# EAGLE board tottag (EAGLE 9.1.1)
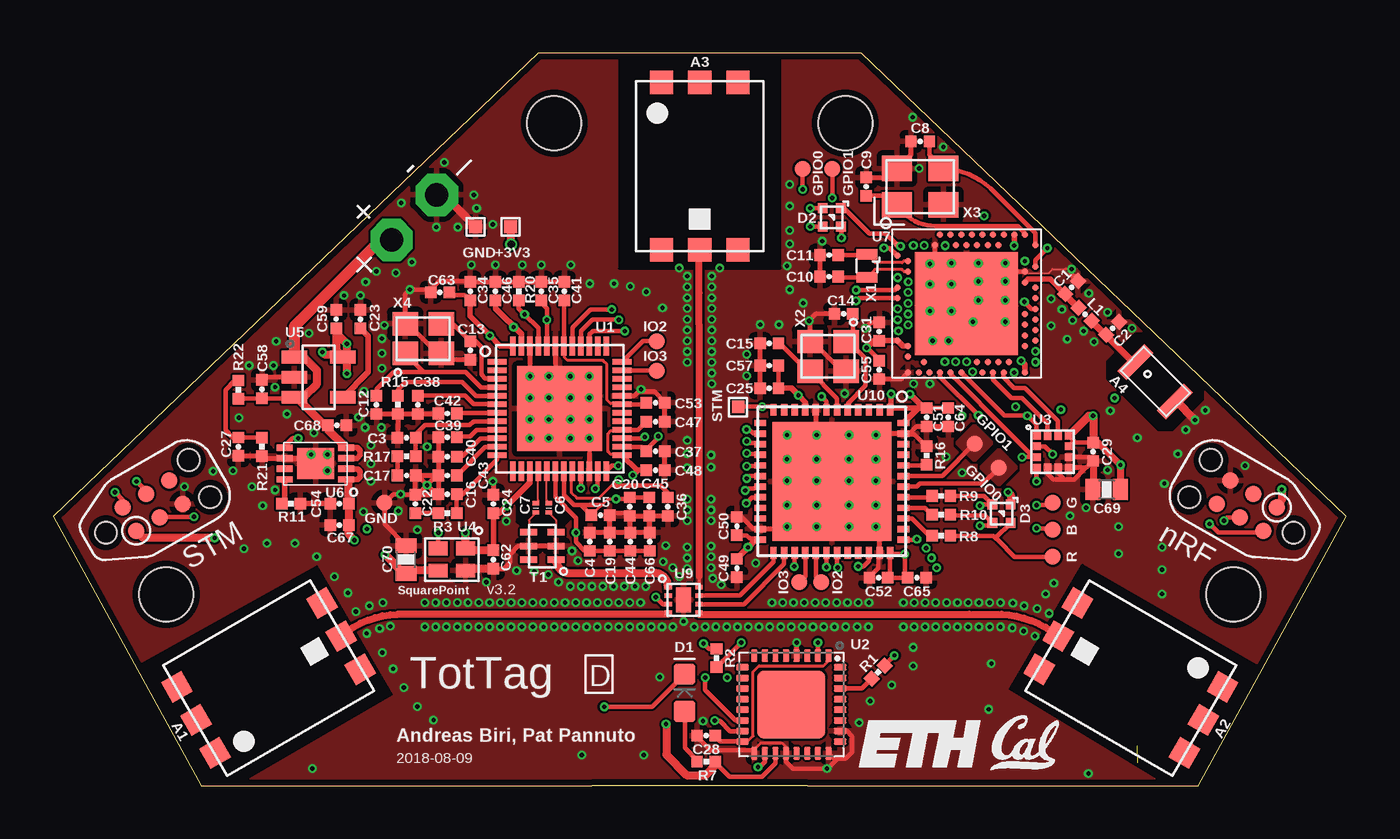
[diagram p4: board, top side]
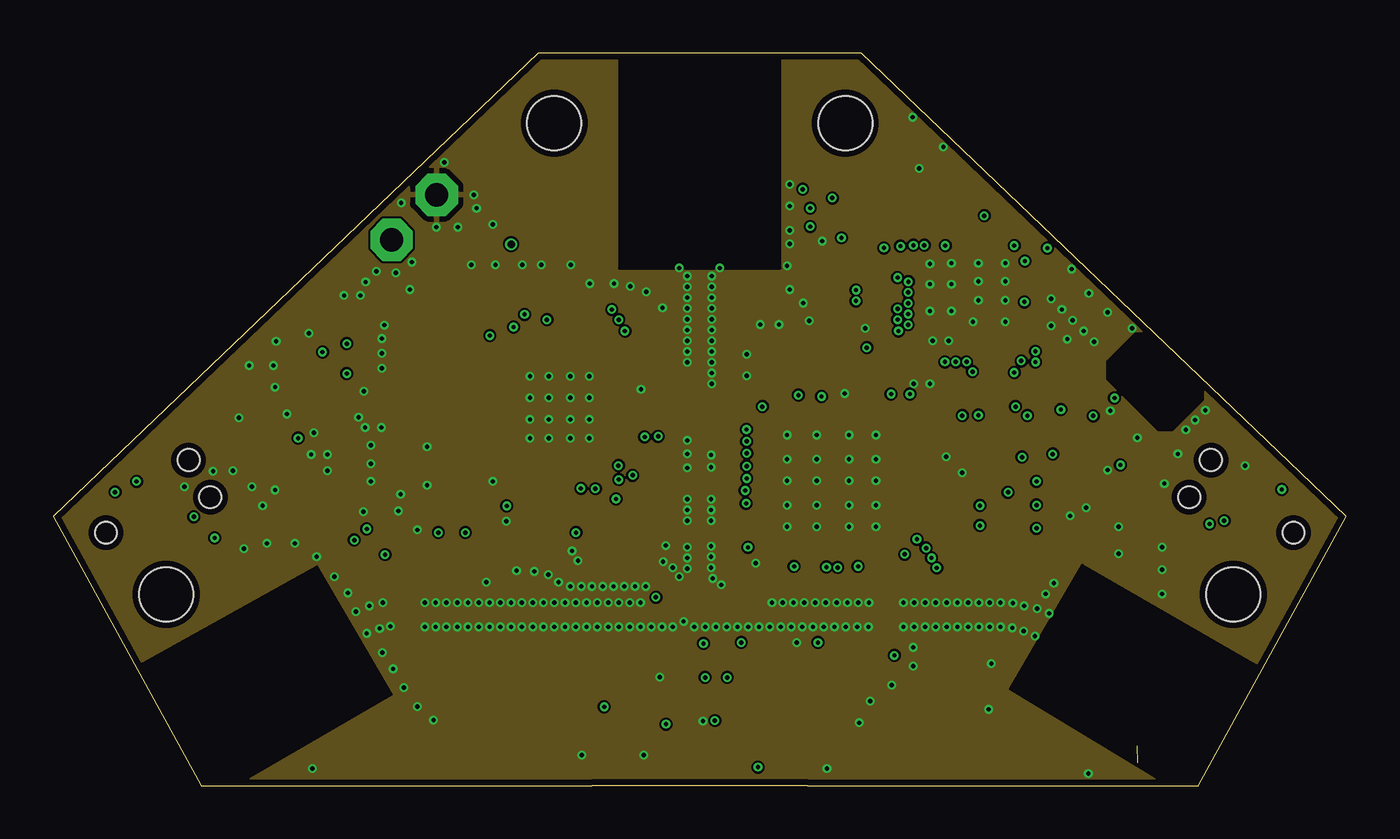
[diagram p5: board, inner layer Route2]
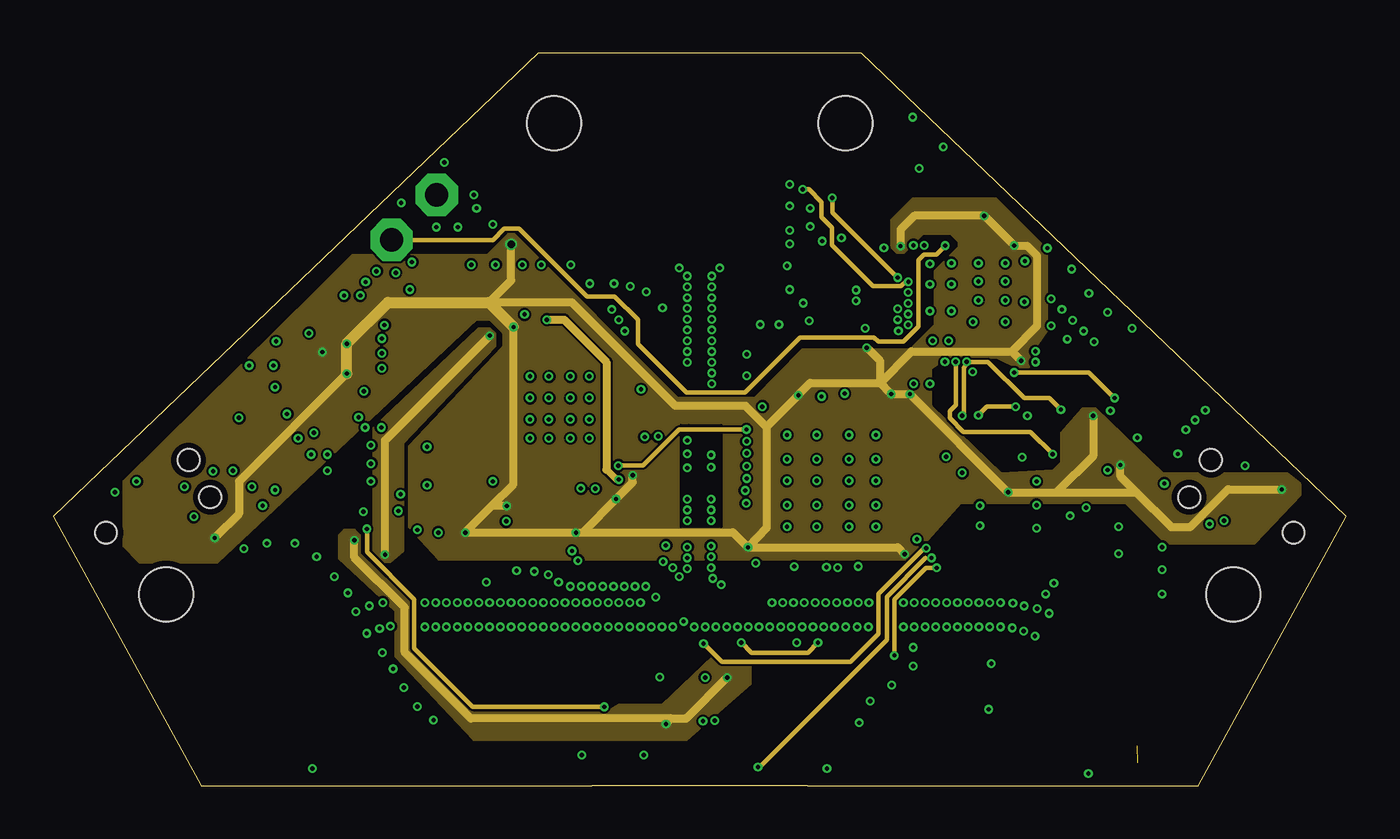
[diagram p6: board, inner layer Route15]
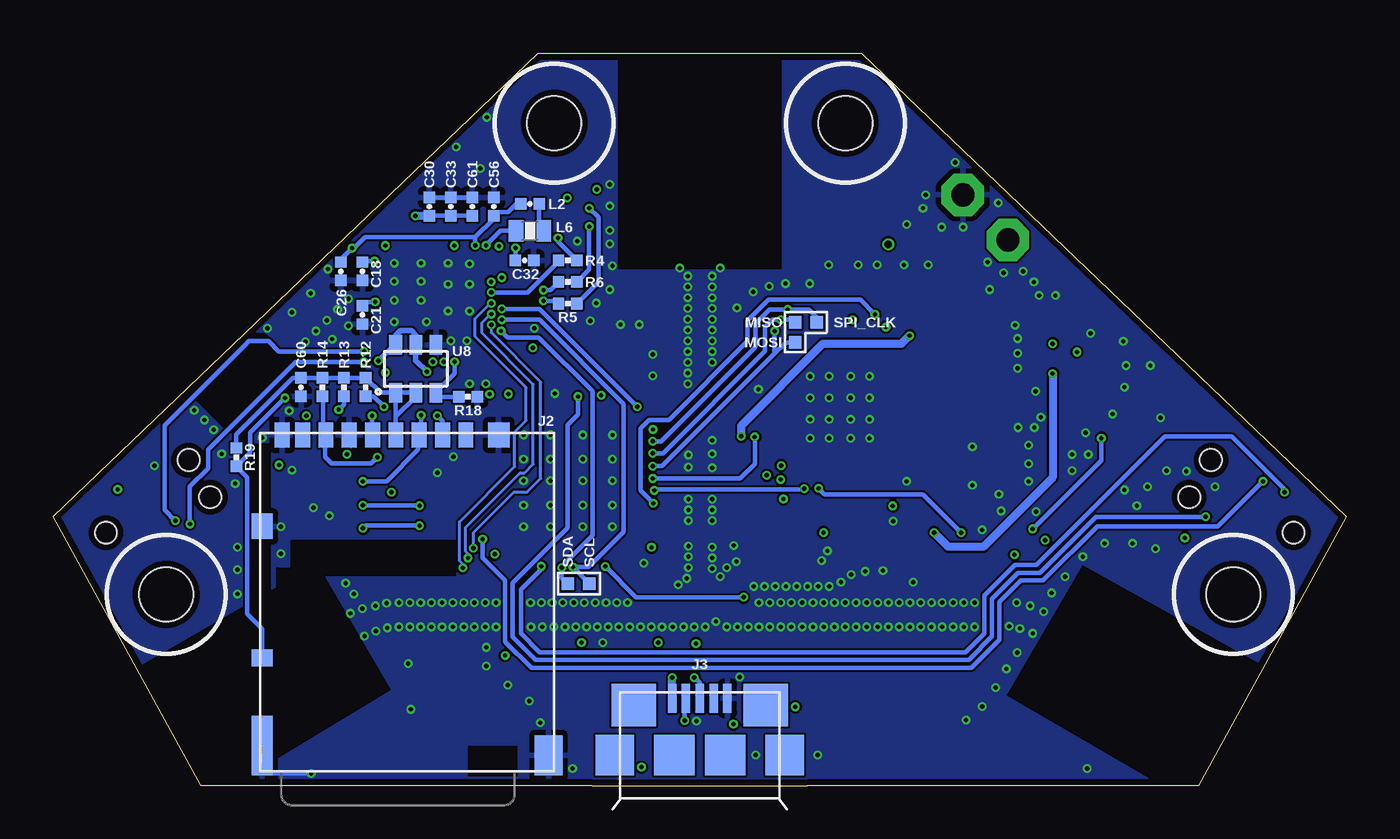
[diagram p7: board, bottom side, seen from below]

Size 60.96 x 34.54 mm. Coordinates in mm from the lower left corner, seen from the top.
Outline: 35.56,0 53.98,0 60.96,12.7 38.1,34.54 22.86,34.54 0,12.7 6.98,0 25.4,0
Copper layers (1+2*15+16): Top 0.0356mm / dielectric 0.18mm / Route2 0.0356mm / dielectric 1.03mm / Route15 0.0356mm / dielectric 0.18mm / Bottom 0.0356mm
Design rules "quickturn_co_kr_1oz_4lyr *": minimum track width 4mil, minimum drill 8mil, track to track 4mil, track to pad 4mil, pad to pad 4mil, via to via 4mil, smd to smd 4mil, copper to edge 12mil, drill to drill 12mil, minimum pad ring 8mil, minimum via ring 4mil, stop-mask expansion 3mil, vias tented up to drill 50mil, thermal gap 10mil
Holes 2.54 mm at 55.63,9.02 5.33,9.02 23.62,31.24 37.34,31.24
tKeepout: area 15.7,7 to 28.7,9; area 30.7,7 to 45.2,9; area 29.5,9.8 to 31.5,22.9
tRestrict: area 4.1,0.1 to 16,10.3; area 45.1,0.3 to 56.9,10.4; area 26.7,24.4 to 34.3,34.4; area 21.8,12.2 to 24.4,14.4
bRestrict: area 4.1,0.1 to 16,10.3; area 45.1,0.3 to 56.9,10.4; area 26.7,24.4 to 34.3,34.4

## Footprints (pad centres in the part's own frame; a part is rotated, then mirrored left to right if it is on the bottom)
TAIYO-YUDEN-AH086M = smd 1.1 x 1.1: A 0,-3.95; NC0 -1.8,3.95; NC1 0,3.95; NC2 1.8,3.95; NC3 1.8,-3.95; NC4 -1.8,-3.95
ANT3216A063R2400A = smd 0.6 x 1.8: S1 -1.325,0; S2 1.325,0
0402_CAP = smd 0.536 x 0.546: 1 -0.433,0; 2 0.433,0
0201_CAP = smd 0.3 x 0.21: P$1 0,0.22; P$2 0,-0.22
0603_CAP = smd 0.7 x 1: 1 -0.65,0; 2 0.65,0
LED-0603 = smd 1 x 1: A -0.877,0; C 0.877,0
1MM_SQ_4PAD = smd 0.457 x 0.457: 1 0.432,0.432; 2 0.432,-0.432; 3 -0.432,-0.432; 4 -0.432,0.432
PAD.03X.03 = smd 0.762 x 0.762: P$1 0,0
BATTERY_HOLE = drill 1.1 pad 2 octagon: N 1.5,0; P -1.5,0
DM3AT-SF-PEJM5 = smd 0.7 x 1.2: 1 3.2,-0.1; 2 2.1,-0.1; 3 1,-0.1; 4 -0.1,-0.1; 5 -1.2,-0.1; 6 -2.3,-0.1; 7 -3.4,-0.1; 8 -4.5,-0.1; B -5.45,-0.1 | smd 1 x 0.8: A -6.4,-10.6 | smd 1 x 1.2: MOUNT0 4.75,-0.1; MOUNT1 -6.4,-4.4 | smd 1 x 2.8: MOUNT2 -6.4,-14.75 | smd 1.3 x 1.9: MOUNT3 7.1,-15.2
USB_MICRO_B-HIROSE-ZX62-B-5PA(11) = smd 0.4 x 1.35: 1 -1.3,4.125; 2 -0.65,4.125; 3 0,4.125; 4 0.65,4.125; 5 1.3,4.125 | smd 2.1 x 2: P$1 3.1,3.8; P$2 -3.1,3.8 | smd 1.8 x 1.9: P$3 -4,1.45; P$6 4,1.45 | smd 1.9 x 1.9: P$4 -1.2,1.45; P$5 1.2,1.45
TC2030-IDC-NL = smd 0.787 x 0.787: 1 -1.27,-0.635; 2 -1.27,0.635; 3 0,-0.635; 4 0,0.635; 5 1.27,-0.635; 6 1.27,0.635 | hole 1.016: -2.54,0; 2.54,1.016; 2.54,-1.016
TP06SQ = smd 0.6 x 0.6: TP 0,0
0402_RES = smd 0.536 x 0.546: 1 -0.433,0; 2 0.433,0
EIA-0805 = smd 0.3 x 0.8: 1 -0.65,-0.65; 2 0,-0.65; 3 0.65,-0.65; 4 0.65,0.65; 5 0,0.65; 6 -0.65,0.65
QFN-48-DW1000 = smd 0.9 x 0.26: 1 -2.95,2.2; 2 -2.95,1.8; 3 -2.95,1.4; 4 -2.95,1; 5 -2.95,0.6; 6 -2.95,0.2; 7 -2.95,-0.2; 8 -2.95,-0.6; 9 -2.95,-1; 10 -2.95,-1.4; 11 -2.95,-1.8; 12 -2.95,-2.2; 25 2.95,-2.2; 26 2.95,-1.8; 27 2.95,-1.4; 28 2.95,-1; 29 2.95,-0.6; 30 2.95,-0.2; 31 2.95,0.2; 32 2.95,0.6; 33 2.95,1; 34 2.95,1.4; 35 2.95,1.8; 36 2.95,2.2 | smd 0.26 x 0.9: 13 -2.2,-2.95; 14 -1.8,-2.95; 15 -1.4,-2.95; 16 -1,-2.95; 17 -0.6,-2.95; 18 -0.2,-2.95; 19 0.2,-2.95; 20 0.6,-2.95; 21 1,-2.95; 22 1.4,-2.95; 23 1.8,-2.95; 24 2.2,-2.95; 37 2.2,2.95; 38 1.8,2.95; 39 1.4,2.95; 40 1,2.95; 41 0.6,2.95; 42 0.2,2.95; 43 -0.2,2.95; 44 -0.6,2.95; 45 -1,2.95; 46 -1.4,2.95; 47 -1.8,2.95; 48 -2.2,2.95 | smd 4 x 4: GND 0,0
QFN32 = smd 0.6 x 0.3: 1 -2.3,1.75; 2 -2.3,1.25; 3 -2.3,0.75; 4 -2.3,0.25; 5 -2.3,-0.25; 6 -2.3,-0.75; 7 -2.3,-1.25; 8 -2.3,-1.75; 17 2.3,-1.75; 18 2.3,-1.25; 19 2.3,-0.75; 20 2.3,-0.25; 21 2.3,0.25; 22 2.3,0.75; 23 2.3,1.25; 24 2.3,1.75 | smd 0.3 x 0.6: 9 -1.75,-2.3; 10 -1.25,-2.3; 11 -0.75,-2.3; 12 -0.25,-2.3; 13 0.25,-2.3; 14 0.75,-2.3; 15 1.25,-2.3; 16 1.75,-2.3; 25 1.75,2.3; 26 1.25,2.3; 27 0.75,2.3; 28 0.25,2.3; 29 -0.25,2.3; 30 -0.75,2.3; 31 -1.25,2.3; 32 -1.75,2.3 | smd 3.2 x 3.2: EXP 0,0
LGA-12 = smd 0.375 x 0.35: 1 -0.75,0.75; 2 -0.75,0.25; 3 -0.75,-0.25; 4 -0.75,-0.75; 7 0.75,-0.75; 8 0.75,-0.25; 9 0.75,0.25; 10 0.75,0.75 | smd 0.35 x 0.375: 5 -0.25,-0.75; 6 0.25,-0.75; 11 0.25,0.75; 12 -0.25,0.75
LXDC2HN = smd 0.65 x 0.9: 1 -0.525,0.65; 2 -0.525,-0.65; 3 0.525,-0.65; 4 0.525,0.65
SOT-23-5 = smd 0.6 x 1.2: 1 -0.95,-1.15; 2 0,-1.15; 3 0.95,-1.15; 4 0.95,1.15; 5 -0.95,1.15
DFN-8-MCP = smd 0.75 x 0.3: 1 -1.45,0.75; 2 -1.45,0.25; 3 -1.45,-0.25; 4 -1.45,-0.75; 5 1.45,-0.75; 6 1.45,-0.25; 7 1.45,0.25; 8 1.45,0.75 | smd 1.75 x 1.45: GND 0,0
AQFN73 = smd 0.3 x 0.3: A8 -1.25,3.25; A10 -0.75,3.25; A12 -0.25,3.25; A14 0.25,3.25; A16 0.75,3.25; A18 1.25,3.25; A20 1.75,3.25; A22 2.25,3.25; A23 2.75,3.25; AA24 3.25,-2.25; AB2 -2.75,-2.5; AC5 -2,-2.75; AC9 -1,-2.75; AC11 -0.5,-2.75; AC13 0,-2.75; AC15 0.5,-2.75; AC17 1,-2.75; AC19 1.5,-2.75; AC21 2,-2.75; AC24 3.25,-2.75; AD2 -2.75,-3.25; AD4 -2.25,-3.25; AD6 -1.75,-3.25; AD8 -1.25,-3.25; AD10 -0.75,-3.25; AD12 -0.25,-3.25; AD14 0.25,-3.25; AD16 0.75,-3.25; AD18 1.25,-3.25; AD20 1.75,-3.25; AD22 2.25,-3.25; AD23 2.75,-3.25; B1 -3.25,2.75; B3 -2.5,2.75; B5 -2,2.75; B7 -1.5,2.75; B9 -1,2.75; B11 -0.5,2.75; B13 0,2.75; B15 0.5,2.75; B17 1,2.75; B19 1.5,2.75; B24 3.25,2.75; C1 -3.25,2.25; D2 -2.75,2; D23 2.75,2; E24 3.25,1.75; F2 -2.75,1.5; F23 2.75,1.5; G1 -3.25,1.25; H2 -2.75,1; H23 2.75,1; J1 -3.25,0.75; J24 3.25,0.75; K2 -2.75,0.5; L1 -3.25,0.25; L24 3.25,0.25; M2 -2.75,0; N1 -3.25,-0.25; N24 3.25,-0.25; P2 -2.75,-0.5; P23 2.75,-0.5; R1 -3.25,-0.75; R24 3.25,-0.75; T2 -2.75,-1; T23 2.75,-1; U1 -3.25,-1.25; U24 3.25,-1.25; V23 2.75,-1.5; W1 -3.25,-1.75; W24 3.25,-1.75; Y2 -2.75,-2; Y23 2.75,-2 | smd 4.85 x 4.85: GND 0,0
TSOT23-6 = smd 0.6 x 0.927: 1 -0.95,-1.126; 2 0,-1.126; 3 0.95,-1.126; 4 0.95,1.126; 5 0,1.126; 6 -0.95,1.126
MLPQ-UT-8 = smd 0.35 x 0.2: 1 -0.725,0.6; 2 -0.725,0.2; 3 -0.725,-0.2; 4 -0.725,-0.6; 5 0.725,-0.6; 6 0.725,-0.2; 7 0.725,0.2; 8 0.725,0.6 | smd 0.7 x 1.2: GND 0,0
UFQFPN-48 = smd 0.55 x 0.3: 1 -3.375,2.75; 2 -3.375,2.25; 3 -3.375,1.75; 4 -3.375,1.25; 5 -3.375,0.75; 6 -3.375,0.25; 7 -3.375,-0.25; 8 -3.375,-0.75; 9 -3.375,-1.25; 10 -3.375,-1.75; 11 -3.375,-2.25; 12 -3.375,-2.75; 25 3.375,-2.75; 26 3.375,-2.25; 27 3.375,-1.75; 28 3.375,-1.25; 29 3.375,-0.75; 30 3.375,-0.25; 31 3.375,0.25; 32 3.375,0.75; 33 3.375,1.25; 34 3.375,1.75; 35 3.375,2.25; 36 3.375,2.75 | smd 0.3 x 0.55: 13 -2.75,-3.375; 14 -2.25,-3.375; 15 -1.75,-3.375; 16 -1.25,-3.375; 17 -0.75,-3.375; 18 -0.25,-3.375; 19 0.25,-3.375; 20 0.75,-3.375; 21 1.25,-3.375; 22 1.75,-3.375; 23 2.25,-3.375; 24 2.75,-3.375; 37 2.75,3.375; 38 2.25,3.375; 39 1.75,3.375; 40 1.25,3.375; 41 0.75,3.375; 42 0.25,3.375; 43 -0.25,3.375; 44 -0.75,3.375; 45 -1.25,3.375; 46 -1.75,3.375; 47 -2.25,3.375; 48 -2.75,3.375 | smd 5.6 x 5.6: GND 0,0
ABS05 = smd 0.5 x 1: A -0.55,0; B 0.55,0
FA-20H = smd 1.1 x 1.2: 1 -0.7,0.85; 2 -0.7,-0.85; 3 0.7,-0.85; 4 0.7,0.85
TXC-7V = smd 1.4 x 1.2: 1 -1.1,-0.85; 2 1.1,-0.85; 3 1.1,0.85; 4 -1.1,0.85

## Placement (x,y rotation side)
A1  TAIYO-YUDEN-AH086M  [TAIYO-YUDEN-AH086M]  10.16,5.08 120 top
A2  TAIYO-YUDEN-AH086M  [TAIYO-YUDEN-AH086M]  50.8,5.08 240 top
A3  TAIYO-YUDEN-AH086M  [TAIYO-YUDEN-AH086M]  30.48,29.21 0 top
A4  ANT3216A063R2400A  [ANT3216A063R2400A]  51.94,19.05 315 top
C1  1pF  [0402_CAP]  48.01,23.49 45 top
C2  1pF  [0402_CAP]  49.94,21.56 45 top
C3  1.2pF  [0402_CAP]  16.66,16.41 180 top
C4  10pF  [0402_CAP]  25.3,11.51 90 top
C5  10pF  [0402_CAP]  25.81,12.75 0 top
C6  12pF  [0201_CAP]  23.37,13.11 0 top
C7  12pF  [0201_CAP]  22.76,13.11 0 top
C8  12pF  [0402_CAP]  40.87,30.38 0 top
C9  12pF  [0402_CAP]  38.33,28.24 270 top
C10  12pF  [0402_CAP]  36.58,24 0 top
C11  12pF  [0402_CAP]  36.58,25.02 0 top
C12  12pF  [0402_CAP]  15.24,17.96 270 top
C13  12pF  [0402_CAP]  19.66,20.52 270 top
C14  12pF  [0402_CAP]  37.26,22.25 180 top
C15  12pF  [0402_CAP]  33.76,20.85 180 top
C16  18pF  [0402_CAP]  18.59,13.74 180 top
C17  27pF  [0402_CAP]  16.66,14.63 0 top
C18  100pF  [0402_CAP]  46.38,24.26 270 bottom
C19  330pF  [0402_CAP]  26.24,11.51 90 top
C20  330pF  [0402_CAP]  27.18,13.16 270 top
C21  820pF  [0402_CAP]  46.38,22.2 270 bottom
C22  820pF  [0402_CAP]  17.07,13.28 90 top
C23  10nF  [0402_CAP]  14.49,22 90 top
C24  10nF  [0402_CAP]  20.75,13.28 90 top
C25  10nF  [0402_CAP]  33.76,18.75 180 top
C26  47nF  [0402_CAP]  47.4,24.26 270 bottom
C27  0.1uF  [0402_CAP]  8.73,15.99 90 top
C28  0.1uF  [0402_CAP]  30.78,2.36 180 top
C29  0.1uF  [0402_CAP]  49.02,15.75 270 top
C30  0.1uF  [0402_CAP]  43.23,27.3 90 bottom
C31  0.1uF  [0402_CAP]  38.94,21.41 90 top
C32  0.1uF  [0402_CAP]  38.73,24.76 0 bottom
C33  0.1uF  [0402_CAP]  42.21,27.3 90 bottom
C34  0.1uF  [0402_CAP]  19.66,23.32 90 top
C35  0.1uF  [0402_CAP]  23.01,23.32 90 top
C36  0.1uF  [0402_CAP]  28.98,13.16 270 top
C37  0.1uF  [0402_CAP]  28.4,15.77 0 top
C38  0.1uF  [0402_CAP]  17.2,17.96 270 top
C39  0.1uF  [0402_CAP]  18.59,16.43 180 top
C40  0.1uF  [0402_CAP]  18.59,15.52 180 top
C41  0.1uF  [0402_CAP]  24.1,23.32 90 top
C42  0.1uF  [0402_CAP]  18.59,17.55 180 top
C43  0.1uF  [0402_CAP]  18.59,14.63 180 top
C44  0.1uF  [0402_CAP]  27.2,11.51 90 top
C45  0.1uF  [0402_CAP]  28.09,13.16 270 top
C46  0.1uF  [0402_CAP]  20.85,23.32 90 top
C47  0.1uF  [0402_CAP]  28.4,17.17 0 top
C48  0.1uF  [0402_CAP]  28.4,14.88 0 top
C49  0.1uF  [0402_CAP]  32.23,10.26 270 top
C50  0.1uF  [0402_CAP]  32.23,12.24 90 top
C51  0.1uF  [0402_CAP]  41.17,17.37 270 top
C52  0.1uF  [0402_CAP]  38.91,9.8 180 top
C53  0.1uF  [0402_CAP]  28.4,18.06 0 top
C54  1uF  [0402_CAP]  13.5,13.3 180 top
C55  1uF  [0402_CAP]  38.94,19.61 270 top
C56  1uF  [0402_CAP]  40.18,27.3 90 bottom
C57  1uF  [0402_CAP]  33.76,19.81 180 top
C58  4.7uF  [0402_CAP]  9.85,18.7 90 top
C59  4.7uF  [0402_CAP]  13.34,22 90 top
C60  4.7uF  [0402_CAP]  49.28,18.8 270 bottom
C61  4.7uF  [0402_CAP]  41.2,27.3 90 bottom
C62  4.7uF  [0402_CAP]  20.75,10.67 90 top
C63  4.7uF  [0402_CAP]  18.24,23.27 180 top
C64  4.7uF  [0402_CAP]  42.19,17.37 270 top
C65  4.7uF  [0402_CAP]  40.72,9.8 0 top
C66  4.7uF  [0402_CAP]  28.12,11.51 90 top
C67  4.7uF  [0402_CAP]  13.5,12.29 180 top
C68  4.7uF  [0402_CAP]  13.39,16.99 0 top
C69  10uF  [0603_CAP]  49.66,13.97 180 top
C70  10uF  [0603_CAP]  16.64,10.67 90 top
D1  GREEN  [LED-0603]  29.77,4.39 90 top
D2  SML-LX0404SIUPGUSB  [1MM_SQ_4PAD]  36.7,26.8 0 top
D3  SML-LX0404SIUPGUSB  [1MM_SQ_4PAD]  44.7,12.83 0 top
GPIO0  TEST-POINT  [PAD.03X.03]  44.58,14.99 0 top
GPIO1  TEST-POINT  [PAD.03X.03]  43.43,16.13 0 top
J1  BAT_HOLE  [BATTERY_HOLE]  17.02,26.8 45 top
J2  CON_MICRO_SDDM3AT-SF-PEJM5  [DM3AT-SF-PEJM5]  44.7,16.64 0 bottom
J3  MICRO_USB_B_HIROSE_ZX62-B-5PA(11)  [USB_MICRO_B-HIROSE-ZX62-B-5PA(11)]  30.48,0 0 bottom
J4  TC2030-JLINK-NL  [TC2030-IDC-NL]  56.26,13.21 150 top
J5  TC2030-JLINK-NL  [TC2030-IDC-NL]  4.7,13.21 30 top
L1  3.9nH  [0402_CAP]  48.64,22.22 135 top
L2  15nH  [0402_CAP]  38.48,27.43 0 bottom
L6  10uH  [0603_CAP]  38.48,26.16 180 bottom
MISO  TPTP06SQ  [TP06SQ]  25.98,21.84 0 bottom
MOSI  TPTP06SQ  [TP06SQ]  25.98,20.9 0 bottom
R1  0  [0402_RES]  38.89,5.36 45 top
R2  0  [0402_RES]  31.27,6.02 90 top
R3  270  [0402_RES]  18.59,12.85 180 top
R4  470  [0402_RES]  36.7,24.76 180 bottom
R5  470  [0402_RES]  36.7,22.73 180 bottom
R6  470  [0402_RES]  36.7,23.75 180 bottom
R7  1k  [0402_RES]  30.78,1.14 0 top
R8  1k  [0402_RES]  41.86,11.79 180 top
R9  1k  [0402_RES]  41.86,13.67 180 top
R10  1k  [0402_RES]  41.86,12.78 180 top
R11  2k 1%  [0402_RES]  11.22,13.3 180 top
R12  10k  [0402_RES]  46.23,18.8 90 bottom
R13  10k  [0402_RES]  47.24,18.8 90 bottom
R14  10k  [0402_RES]  48.26,18.8 90 bottom
R15  11k 1%  [0402_RES]  16.26,17.96 90 top
R16  11k  [0402_RES]  41.17,15.57 90 top
R17  16k  [0402_RES]  16.66,15.54 180 top
R18  100k  [0402_RES]  41.4,18.34 0 bottom
R19  100k  [0402_RES]  52.32,15.49 90 bottom
R20  100k  [0402_RES]  21.95,23.32 270 top
R21  2.2M  [0402_RES]  9.85,15.98 90 top
R22  10M  [0402_RES]  8.73,18.67 270 top
SPI_CLK  TPTP06SQ  [TP06SQ]  24.97,21.84 0 bottom
T1  HHM1595A1  [EIA-0805]  23.06,11.3 90 top
TP1  TPTP06SQ  [TP06SQ]  35.69,9.53 0 bottom
TP2  TPTP06SQ  [TP06SQ]  36.7,9.53 0 bottom
TP3  TPTP06SQ  [TP06SQ]  32.3,17.87 0 top
TP4  TPTP06SQ  [TP06SQ]  19.91,26.36 0 top
TP5  TEST-POINT  [PAD.03X.03]  36.2,9.6 0 top
TP6  TEST-POINT  [PAD.03X.03]  35.18,9.6 0 top
TP7  TEST-POINT  [PAD.03X.03]  47.12,13.34 0 top
TP8  TEST-POINT  [PAD.03X.03]  47.12,10.79 0 top
TP9  TEST-POINT  [PAD.03X.03]  47.12,12.07 0 top
TP10  TEST-POINT  [PAD.03X.03]  15.62,13.34 0 top
TP11  TEST-POINT  [PAD.03X.03]  28.45,20.95 0 top
TP12  TEST-POINT  [PAD.03X.03]  28.45,19.56 0 top
TP13  TEST-POINT  [PAD.03X.03]  35.33,29.08 0 top
TP14  TEST-POINT  [PAD.03X.03]  36.73,29.08 0 top
TP15  TPTP06SQ  [TP06SQ]  21.56,26.37 0 top
U1  DW1000  [QFN-48-DW1000]  23.88,17.78 0 top
U2  FT232RQ  [QFN32]  34.8,3.84 270 top
U3  LIS2DW12  [LGA-12]  47.12,15.75 0 top
U4  LXDC2HN18A  [LXDC2HN]  18.8,10.67 270 top
U5  MAX8887EZK33+T  [SOT-23-5]  12.52,19.26 270 top
U6  MCP73831  [DFN-8-MCP]  12.37,15.19 180 top
U7  NRF52840  [AQFN73]  43.05,22.73 0 top
U8  SIP32510  [TSOT23-6]  43.87,19.66 0 bottom
U9  SKY13317  [MLPQ-UT-8]  29.72,8.76 0 top
U10  STM32F091CC  [UFQFPN-48]  36.7,14.35 270 top
U$3  [ETH_200MIL]  40.64,0.89 0 top
U$4  [UCB_CAL_100MIL]  44.2,0.76 0 top
X1  32.768kHz  [ABS05]  38.35,24.51 270 top
X2  16MHz  [FA-20H]  36.53,20.24 270 top
X3  32MHz  [TXC-7V]  40.87,28.24 0 top
X4  38.4MHz  [FA-20H]  17.45,21.08 90 top

## Tracks (layer width: path | path; a pad name or v marks a point on that pad's centre or on a via)
!CHRG
  Top 0.203: R7.1 30.35,1.21 29.78,1.78 D1.A
!DW_RST  (via drill 0.2)
  Top 0.203: U1.27 27.82,16.38 v27.89,16.45 | U10.18 33.31,14.62 32.82,14.62 v32.69,14.49
  Bottom 0.203: v32.69,14.49 28.58,14.49 27.89,15.18 v27.89,16.45
!DW_SPI_CS  (via drill 0.2)
  Top 0.203: U1.24 26.34,15.09 v26.64,15.09 | U10.14 33,16.6 32.81,16.79 v32.68,16.79
  Route15 0.203: v32.68,16.79 29.51,16.79 27.81,15.09 v26.64,15.09
!FT_RST  (via drill 0.2)
  Top 0.203: v33.22,0.88 33.3,0.88 33.55,1.13 U2.18 | U7.P2 v40.3,22.24
  Route15 0.152: v33.22,0.88 33.3,0.88 | 41.12,10.74 v41.4,10.74
  Route15 0.203: 33.3,0.88 39.29,6.87 39.29,8.92 41.12,10.74
  Bottom 0.152: v41.4,10.74 41.4,10.92 41.53,11.05 41.53,12.17 38.94,14.76 38.73,14.76 38.33,15.16 38.33,18.93 40.73,21.33 40.73,21.84 40.33,22.24 v40.3,22.24
!NRF_CS_IMU  (via drill 0.2)
  Top 0.203: U7.AC11 v42.55,19.98 | v47.12,15.63 46.75,16 U3.2
  Route15 0.203: v47.12,15.63 46.06,16.69 42.91,16.69 42.27,17.33 42.27,17.67 42.55,17.95 v42.55,19.98
!NRF_CS_SD  (via drill 0.2)
  Route15 0.203: v42.85,17.45 42.93,17.53 42.93,19.73 43.05,19.86 U7.AC13 44.07,19.98 45.77,18.28 46.95,18.28 v47.5,17.74 | v47.5,17.74
  Bottom 0.203: J2.2 42.6,17.2 v42.85,17.45 | v47.5,17.74 v47.49,17.74 47.24,17.98 R13.1
  other vias: 43.05,19.98
!SD_DETECT  (via drill 0.2)
  Route15 0.203: v50.03,18.28 48.83,19.48 U7.AD22
  Bottom 0.203: J2.A 51.1,7.4 51.81,8.11 51.81,14.54 R19.1 51.67,15.72 51.67,16.67 50.05,18.28 v50.03,18.28
  other vias: 45.3,19.48
!STM_RST  (via drill 0.2)
  Top 0.203: U10.7 36.45,18.12 v36.22,18.35 | J5.3 5.04,12.68 v6.64,12.68
  Bottom 0.203: v36.22,18.35 36.22,17.5 36.7,17.02 36.7,12.16 39.29,9.57 39.29,7.01 38.23,5.94 17.81,5.94 16.71,7.04 16.71,8.81 15.5,10.03 14.45,10.03 11.81,12.68 v6.64,12.68
+1V8  (via drill 0.2)
  Top 0.203: U1.26 27.76,15.98 C37.1 27.96,15.85 28.52,16.41 v28.52,16.47 | C63.1 18.66,23.25 18.66,23.14 19.41,23.14 C34.1 | v20.59,21.22
  Top 0.254: U1.48 21.08,20.73 v20.59,21.22 19.66,22.15 C34.1
  Top 0.381: U4.3 16.76,10.14 C70.1 16.52,10.02 v15.65,10.9
  Route15 0.203: v20.59,21.22
  Route15 0.381: v15.65,10.9 15.65,16.28 v20.59,21.22
  Bottom 0.203: v20.59,21.22
  Bottom 0.381: v20.59,21.22 20.96,20.84 24.66,20.84 28.52,16.98 v28.52,16.47
  pour Route15: 20.07,21.59 20.57,21.59 20.83,21.34 20.83,20.7 16.51,16.13 16.51,11.05 15.88,10.54 15.62,10.54 15.11,11.05 15.11,16.89
+3V3  (via drill 0.2, 0.35)
  Top 0.102: U1.28 26.79,16.74 | U1.25 | v32.75,11.24
  Top 0.152: U1.25 26.79,15.62 26.28,15.62 26.15,15.76 26.15,16.61 26.28,16.74 26.79,16.74 | C5.1 25.81,13.18 25.87,13.25 26.15,13.52 v26.54,13.52
  Top 0.203: 40.78,17.81 C51.1 | C51.1 C64.1 | 39.53,17.81 U10.1 39.5,17.77 | U10.36 39.45,9.91 C52.1 C65.1 40.16,9.93 40.16,10.9 v40.14,10.92 | 33.11,11.6 U10.24 33.28,11.65 32.85,11.65 32.69,11.81 C50.1 | U1.18 23.68,13.61 24.65,12.64 v24.65,11.94 24.65,11.49 25.06,11.07 C4.1 C19.1 C44.1 C66.1 | 24.89,13.23 24.55,13.23 24.08,13.71 U1.19 | 27.52,14.88 C48.1 | C47.1 27.57,16.78 U1.28 | 32.23,10.72 C49.1 | 24.89,13.23 C5.1 | C45.1 C20.1 27.11,13.52 v26.54,13.52 | C25.1 C57.1 | 24.89,13.23 25.82,13.23 | U10.9 35.47,17.74 | 21.72,21.63 v21.7,21.63 | C51.1 41.05,17.81 | 39.85,25.44 U7.B1 39.24,26.04 38.48,26.04 37.29,27.23 D2.1 | 38.99,20.98 C31.1 38.68,20.98 | C55.1 38.94,20.07 v38.35,20.65 | 21.04,12.85 C24.1 | U3.9 48.05,16.18 48.13,16.18 | 48.13,16.18 C29.1 | U3.10 48.13,16.23 48.13,16.18 | U7.AD14 v43.34,19.52
  Top 0.254: U10.48 40.78,17.81 | 41.05,17.81 v40.39,18.47 | C51.1 39.53,17.81 | 33.11,11.6 v32.75,11.24 32.23,10.72 | 22.07,21.29 22.07,20.75 U1.47 | 22.07,21.29 20.85,22.49 C46.1 | U1.15 22.48,14.29 v21.38,13.2 21.04,12.85 | C24.1 C62.2 | U1.25 27.52,14.88 | v27.32,14.64 27.57,14.88 C48.1 | v39.5,18.47 39.5,17.77 | 35.47,17.74 35.47,18.07 v35.13,18.41 34.8,18.75 C25.1 | U7.Y2 40.05,20.73 U7.W1 38.99,20.98 | U7.AD23 45.8,19.86 v45.63,20.03 | v45.3,25.46 U7.A22 | 39.85,25.44 v39.94,25.44 | 38.68,20.98 v38.35,20.65 | v40.14,10.92 39.51,10.92 U10.36 | 22.07,21.29 21.72,21.63
  Top 0.33: C69.1 v50.31,15.13 49.25,16.18 C29.1
  Top 0.381: C62.2 19.54,11.1 U4.1 19.45,11.92 v19.43,11.94 | v57.91,13.97 57.91,13.46 57.68,13.22 J4.1 | U5.5 13.34,20.54 C59.1 13.34,21.34 v13.84,20.84 13.84,20.04 | U5.5 13.84,20.04 | 13.84,20.04 v13.84,19.43 | v7.62,11.68 4.26,11.68 J5.1 | v21.59,25.53 21.59,26.34 TP15.TP | D3.1 45.14,13.71 v45.01,13.84 | C29.1 v49.02,17.44 48.81,17.44 U3.10 | v12.7,20.45 12.83,20.31 13.57,20.31 U5.5
  Route15 0.203: v24.65,11.94 24.64,11.95 | v35.13,18.41 35.12,18.43 | v43.89,26.87
  Route15 0.381: 21.7,14.21 v21.7,21.63 21.7,14.21 | 32.04,11.95 v32.75,11.25 | v19.43,11.94 20.7,13.21 | 20.7,13.21 21.7,14.21 | v40.14,10.92 39.81,11.24 v32.75,11.25 | 24.97,11.95 32.04,11.95 | v27.32,14.64 27.32,14.31 v26.54,13.52 24.97,11.96 | 19.44,11.95 v19.43,11.94 | 38.99,19 35.68,19 35.12,18.43 | 20.7,13.21 21.37,13.21 v21.38,13.2 | 24.97,11.96 24.97,11.95 | v24.65,11.95 24.97,11.94 v24.65,11.94 | v24.65,11.94 24.97,11.95 | v24.65,11.95 24.97,11.95 | 24.97,11.96 24.97,11.95 | 24.97,11.95 32.04,11.95 | 24.97,11.96 24.97,11.95 | 24.97,11.96 24.97,11.95 | 24.97,11.95 | v24.65,11.94 24.97,11.95 | v24.65,11.95 24.97,11.95 | v24.65,11.95 24.97,11.95 | v24.65,11.95 24.97,11.95 | 24.97,11.96 24.97,11.95 | 20.7,13.21 | v32.75,11.25 v32.75,11.24 | v19.43,11.94 19.44,11.95 | v19.43,11.94 20.7,13.21 | v19.43,11.94 20.7,13.21 | 20.7,13.21 21.7,14.21 | 20.7,13.21 21.7,14.21 | 19.44,11.95 24.64,11.95 | 24.97,11.95 | 19.44,11.95 24.97,11.95 | 19.44,11.95 | 19.44,11.95 24.97,11.95 | 24.97,11.95 32.04,11.95 | 19.44,11.95 24.64,11.95 | 24.64,11.95 24.97,11.95 | v32.75,11.25 33.63,12.16 33.63,16.92 | 19.44,11.95 v19.43,11.94 | 19.44,11.95 v19.43,11.94 | v32.75,11.25 | v13.84,19.43 8.76,14.35 8.76,12.83 v7.62,11.68 | v35.13,18.41 33.63,16.92 | 51.06,13.84 52.7,12.19 53.59,12.19 55.37,13.97 v57.91,13.97 | v38.35,20.65 38.99,20.02 38.99,19 | 45.18,20.48 40.44,20.48 40.44,20.45 38.99,19 | 45.18,20.48 v45.63,20.03 | 38.99,19 38.99,18.98 v39.5,18.47 v40.38,18.47 v45.01,13.84 47.32,13.84 | v21.59,25.53 21.59,23.83 20.55,22.78 24.46,22.78 29.34,17.91 32.64,17.91 33.63,16.92 | v49.02,17.44 49.02,15.54 47.32,13.84 | 47.32,13.84 51.06,13.84 | 51.06,13.84 50.31,14.59 v50.31,15.13
  Route15 0.381: 45.18,20.48 46.38,21.68 46.38,24.98 45.91,25.46 v45.31,25.46 v45.3,25.46 v43.89,26.87 40.59,26.87 39.94,26.23 v39.94,25.44
  Route15 0.508: v21.7,21.63 20.55,22.78 15.79,22.78 v13.84,20.84 v13.84,19.43
  Bottom 0.203: U8.5 43.87,21.26 | 44.82,21.22 U8.6 44.87,20.79 | C30.1 C33.1 C61.1 | v43.89,26.87 | v43.89,26.87
  Bottom 0.254: 43.87,21.26 44.07,21.46 44.58,21.46 44.82,21.22 | v45.63,20.03 44.87,20.79 | v43.34,19.52 43.87,20.05 U8.5
  Bottom 0.381: v13.84,19.43 13.84,14.54 17.12,11.27 18.77,11.27 19.43,11.93 v19.43,11.94 | v43.89,26.87 C30.1
  pour Route15: 12.45,23.37 3.3,14.35 3.3,11.3 4.06,10.54 7.76,10.54 19.96,21.97 20.57,21.97 21.21,21.34 21.21,20.71 16.76,16 16.76,12.19 18.16,10.67 40.26,10.67 40.64,10.92 42.8,13.34 50.55,13.34 52.45,11.43 56.64,11.43 58.8,13.72 58.8,14.22 58.17,14.73 52.32,14.73 49.15,17.78 48.51,17.78 47.5,16.64 47.5,15.24 47.12,14.86 44.7,14.73 41.4,17.91 41.4,19.68 42.16,20.19 44.45,20.19 45.47,19.68 45.97,19.68 46.36,20.07 46.36,20.7 46.86,21.46 46.86,25.27 44.45,27.69 40.51,27.69 39.5,26.67 39.5,25.4 39.75,25.15 40.13,25.15 41.02,26.04 42.29,26.04 42.67,25.65 42.67,25.4 41.53,24.26 41.53,21.72 40.39,20.57 35.31,20.57 33.05,18.29 29.46,18.29 21.72,26.04 21.46,26.04 20.45,25.02 14.1,25.02
ANT_SEL1  (via drill 0.2)
  Top 0.152: U9.3 29.07,8.56
  Top 0.203: U10.27 34.95,10.37 v34.92,10.34 | v28.41,8.89 28.75,8.56 29.07,8.56
  Bottom 0.203: v34.92,10.34 33.48,8.89 v28.41,8.89
ANT_SEL2
  Top 0.203: U9.6 32.57,8.56 34.45,10.45 U10.26
ANT_SEL3
  Top 0.203: U10.25 33.95,10.54 32.38,8.97 30.37,8.97 U9.7
BATIN
  Top 0.203: R21.2 8.74,16.41 C27.2 8.47,16.42 8.13,16.76 8.13,18.67 8.56,19.11 R22.1
D+  (via drill 0.2)
  Top 0.203: U2.14 32.17,3.08 30.73,4.52 v30.73,5.11
  Bottom 0.203: v30.73,5.11 30.48,4.85 J3.3
D-  (via drill 0.2)
  Top 0.203: U2.15 31.92,2.58 31.42,3.07 v31.19,3.07
  Bottom 0.203: v31.19,3.07 31.19,4.06 J3.2
DBG_RX  (via drill 0.2)
  Top 0.203: U7.M2 v40.3,22.75 | R1.2 39.16,5.66 v39.65,6.14
  Route15 0.203: v41.65,10.28 41.14,10.28 39.65,8.79 v39.65,6.15 v39.65,6.14
  Bottom 0.152: v41.65,10.28 41.65,10.45 41.81,10.61 41.81,12.44 39.2,15.05 39.2,16.68 38.66,17.22 38.66,18.77 41.06,21.18 41.06,22.02 40.33,22.75 v40.3,22.75
DBG_TX  (via drill 0.2)
  Top 0.203: v30.66,6.71 30.91,6.45 R2.2
  Route15 0.203: v30.66,6.71 31.52,5.84 37.58,5.84 38.91,7.17 38.91,9.04 41.08,11.21 v41.15,11.21
  Bottom 0.152: v41.15,11.21 41.15,11.94 39.24,13.84 38.61,13.84 37.97,14.48 37.97,19.03 40.3,21.36 U7.T2
  other vias: 40.3,21.73
DW_IRQ  (via drill 0.2)
  Top 0.203: U1.45 22.88,21.57 v22.22,22.22 v22.23,22.22 21.97,22.48 21.95,22.5 R20.2 | U10.20 32.95,13.6 v32.66,13.31
  Bottom 0.203: v32.66,13.31 33.27,13.92 33.27,16.85 32.87,17.25 31.92,17.25 28.22,20.95 28.22,21.94 27.25,22.91 22.91,22.91 v22.23,22.22 | v22.23,22.22
DW_SPI_CLK  (via drill 0.2)
  Top 0.203: U1.41 24.48,21.59 25.34,22.45 v26.33,22.45 | v32.69,16.24 32.77,16.15 33.28,16.15 U10.15
  Bottom 0.203: v32.69,16.24 32.31,16.24 27.86,20.68 27.86,21.79 27.2,22.45 v26.33,22.45 25.32,22.45 24.97,22.1 SPI_CLK.TP
DW_SPI_MISO  (via drill 0.2)
  Top 0.203: U1.40 24.89,20.75 24.89,21.44 25.43,21.97 v26.66,21.97 | v32.7,15.68 32.72,15.65 33.28,15.65 U10.16
  Bottom 0.203: v32.7,15.68 32.22,15.68 27.41,20.49 27.41,21.63 27.06,21.97 v26.66,21.97 | v26.66,21.97 | MISO.TP 26.11,21.97 v26.66,21.97
DW_SPI_MOSI  (via drill 0.2)
  Top 0.203: U1.39 25.29,20.75 25.29,21.29 25.44,21.43 v26.95,21.43 v26.95,21.44 | v32.69,15.07 v32.7,15.08 33.3,15.08 U10.17
  Bottom 0.203: v32.69,15.07 32.25,15.07 26.95,20.37 | 26.95,20.37 v26.95,21.44 | MOSI.TP 26.42,20.9 26.95,20.37
DW_WAKEUP  (via drill 0.2)
  Top 0.203: 25.66,14.82 25.66,14.11 v25.56,14.01 | U10.19 33.12,14.1 33.05,14.03 32.72,14.03 v32.62,13.92 | U1.23 25.66,14.82 | 25.66,14.82
  Bottom 0.203: v25.56,14.01 25.59,13.98 32.68,13.98 v32.62,13.92 | v32.62,13.92
EXT_I2C_SCL  (via drill 0.2)
  Top 0.203: U10.30 v36.45,10.31 | v39.8,21.97 U7.R1
  Bottom 0.203: TP1.TP 35.69,9.55 v36.45,10.31 35.71,10.31 34.06,11.96 34.06,18 38.03,21.97 v39.8,21.97
EXT_I2C_SDA  (via drill 0.2)
  Top 0.203: U10.31 36.95,10.32 v36.98,10.29 | v39.84,21.44 U7.U1
  Bottom 0.203: TP2.TP 36.98,9.8 v36.98,10.29 36.98,10.35 35.54,11.79 35.54,18.61 38.07,21.14 39.54,21.14 v39.84,21.44
GND  (via drill 0.2)  (1 unrouted)
  Top 0.102: 42.8,23.37 42.8,22.99 U7.GND 41.33,24.46 v41.33,24.61 | U7.F23 45.86,24.18 46.94,24.18 47.12,24.36 47.7,24.36 v48.01,24.36
  Top 0.152: 32.91,1.67 33.01,1.67 33.35,2.01 34.37,2.01 34.55,1.83 U2.20 | 22.48,19.18 22.73,18.92 U1.GND | U1.GND v25.28,16.38 | U1.GND v25.27,16.38
  Top 0.203: 40.33,16.57 40.11,16.57 U10.47 39.08,16.6 | 40.33,16.57 40.7,16.94 C51.2 C64.2 | R16.2 40.61,16.57 40.33,16.57 | 36.96,14.1 38.95,12.1 U10.35 | 36.96,14.1 36.77,14.29 | 36.96,14.1 34.96,12.1 U10.23 33.01,12.1 32.44,12.68 C50.2 | U10.8 35.95,15.1 | U10.8 35.98,17.76 U10.8 | 39.08,16.6 36.77,14.29 | C52.2 38.48,9.84 38.91,10.27 38.91,10.93 U10.35 | U1.43 23.68,18.06 23.68,17.98 | 23.68,17.98 U1.GND | U1.46 22.48,19.18 22.73,18.92 23.68,17.98 | v25.28,16.38 U1.22 | C42.2 18.13,17.52 C38.2 R15.1 | C12.2 R15.1 | R15.1 16.26,16.43 C3.2 | C39.2 C40.2 C43.2 | C43.2 C17.2 17.07,14.6 | C43.2 C16.2 | C16.2 18.14,13.72 C22.2 | C24.2 20.75,14.33 v20.73,14.35 | C62.1 21.24,10.23 21.53,10.52 21.53,10.91 21.93,11.3 T1.5 T1.2 | C44.2 C66.2 28.12,12.7 | C44.2 C19.2 | C19.2 C4.2 C19.2 | C19.2 C5.2 | C5.2 | C44.2 27.2,12.7 | 27.2,12.7 C20.2 27.05,12.85 | 28.12,12.7 C45.2 C36.2 | 27.2,12.7 28.12,12.7 | C48.2 C37.2 | C47.2 C53.2 | 28.74,18.06 C53.2 | U1.32 27.39,18.38 27.59,18.59 28.34,18.59 28.83,18.09 C53.2 | 26.34,12.85 27.05,12.85 | C5.2 | C22.2 17.07,14.6 | C70.2 15.62,12.33 TP10.P$1 16.03,13.74 v16.38,13.74 17.05,13.74 C22.2 | C25.2 C57.2 C15.2 | X2.4 37.18,19.54 36.13,20.6 36.14,20.6 35.8,20.94 X2.2 35.67,21.88 v35.64,21.92 v35.63,21.92 35.97,22.25 C14.2 | C13.2 18.59,20.09 X4.2 18.12,20.38 16.72,21.78 X4.4 16.6,23.18 v16.82,23.39 17.68,23.39 C63.2 17.8,23.29 17.75,23.35 18.2,23.79 19.62,23.79 C34.2 C46.2 R20.1 C35.2 C41.2 | U10.8 35.95,15.1 | 35.95,15.1 U10.GND | C5.2 | C19.2 C5.2 | C5.2 26.34,12.85 | C19.2 C5.2 | C19.2 C5.2 | C5.2 | 35.95,15.1 U10.GND | U10.8 35.95,15.1 | C19.2 C5.2 | C19.2 C5.2 | C5.2 | 36.77,14.29 U10.GND | 36.77,14.29 | C44.2 C19.2 | 26.34,12.85 27.05,12.85
  Top 0.203: U10.8 35.95,15.1 | C5.2 26.34,12.85 | C5.2 26.34,12.85 | 35.95,15.1 U10.GND | C5.2 26.34,12.85 | 39.08,16.6 36.77,14.29 | C27.1 8.74,15.54 R21.1 9.95,15.44 U6.6 | U5.2 9.98,19.26 C58.2 | 36.98,1.27 37.35,1.27 37.65,1.58 37.65,2.34 37.41,2.58 U2.26 | 36.98,1.27 36.51,0.8 34.87,0.8 34.54,1.13 U2.20 | U2.24 36.81,1.27 36.98,1.27 | U2.17 32.91,1.67 30.98,1.67 30.35,2.3 C28.2 | U7.F23 44.09,24.23 43.94,24.38 43.05,23.49 43.05,23.11 | 43.05,23.11 U7.GND | U7.B7 41.55,24.61 42.8,23.37 43.05,23.11 | C11.1 C10.1 | C8.1 40.44,29.76 X3.4 39.35,28.68 C9.1 | U7.AD2 40,19.18 C55.2 | C31.2 38.56,21.84 v38.28,21.57 | U10.35 | 48.64,15 48.7,15 C29.2 48.84,15.5 U3.8 | U3.7 48.51,15 48.64,15 | U3.6 47.37,14.76 47.68,14.45 47.88,14.45 | 47.88,14.45 48.13,14.45 48.64,14.96 48.64,15 | U3.5 46.87,14.73 47.14,14.45 47.88,14.45 | U2.4 v35.05,6.75 | v17.63,14.17 17.2,14.6 17.07,14.6 | v17.63,14.17 18.09,14.63 C43.2 | v17.63,14.17 17.17,13.72 C22.2 | v17.63,14.17 18.06,13.74 C16.2
  Top 0.254: C54.2 R11.1 | U6.6 12.12,15.44 U6.GND | v48.01,24.36 48.01,24.11 C1.2 | v35.05,6.75 v35.05,6.76 | R11.1 11.78,13.17 11.65,13.17 | R11.1
  Top 0.33: C29.2 49.02,13.99 C69.2
  Top 0.381: C62.1 19.54,10.23 U4.4 | TP4.TP 18.41,27.86 J1.N | v53.82,17.25 52.96,18.11 A4.S2
  Bottom 0.203: C30.2 C33.2 C61.2 | v48.79,0.58 50.63,0.58 51.12,1.08 | 49.28,18.26 C60.2 | 50.16,16.53 J2.B
  other vias: 15.54,8.64 17.53,8.64 18.03,8.64 18.54,8.64 19.05,8.64 19.56,8.64 20.07,8.64 20.57,8.64 21.08,8.64 21.59,8.64 22.1,8.64 22.61,8.64 23.11,8.64 23.62,8.64 24.13,8.64 24.64,8.64 25.15,8.64 25.65,8.64 26.16,8.64 26.67,8.64 27.18,8.64 27.69,8.64 27.94,9.4 27.43,9.4 26.92,9.4 26.42,9.4 25.91,9.4 25.4,9.4 24.89,9.4 24.38,9.4 23.83,9.6 23.34,9.96 22.68,10.11 28.75,10.57 29.21,10.29 29.51,9.86 29.9,10.24 29.9,10.74 29.9,11.25 29.9,12.5 29.9,13 29.9,13.51 29.9,14.99 29.9,15.65 29.9,16.28 31.01,15.6 31.01,15.01 29.9,19.96 29.9,20.47 29.9,20.98 29.9,21.49 29.9,22 29.9,22.5 31.04,22.5 31.04,22 31.04,21.49 31.04,20.98 31.04,20.47 31.04,19.96 31.04,19.46 31.04,18.95 31.01,13.51 31.01,13 31.01,12.5 31.01,11.3 31.01,10.79 31.01,10.29 31.09,9.78 31.5,9.47 33.88,8.64 34.39,8.64 34.9,8.64 35.41,8.64 35.92,8.64 36.42,8.64 36.93,8.64 37.44,8.64 37.95,8.64 38.46,8.64 40.08,8.64 40.59,8.64 41.1,8.64 41.61,8.64 42.11,8.64 42.62,8.64 43.13,8.64 43.64,8.64 44.15,8.64 44.65,8.64 25.27,19.3 23.37,19.3 22.48,19.3 22.48,18.29 23.37,18.29 24.38,19.3 25.27,18.29 24.38,18.29 25.27,17.27 24.38,16.38 23.37,16.38 22.48,16.38 22.48,17.27 23.37,17.27 24.38,17.27 34.59,16.54 35.99,16.54 37.52,16.54 38.79,16.54 38.79,15.39 37.52,15.39 34.59,15.39 37.52,14.38 38.79,14.38 35.99,14.38 35.99,13.23 35.99,12.22 34.59,12.22 37.52,12.22 38.79,12.22 38.79,13.23 37.52,13.23 34.59,13.23 32.69,19.33 14.91,8.48 15.9,7.52 17.53,7.49 18.03,7.49 18.54,7.49 19.05,7.49 19.56,7.49 20.07,7.49 20.57,7.49 21.08,7.49 21.59,7.49 22.1,7.49 22.61,7.49 23.11,7.49 23.62,7.49 24.13,7.49 24.64,7.49 25.15,7.49 25.65,7.49 26.16,7.49 26.67,7.49 27.18,7.49 27.69,7.49 28.19,7.49 28.7,7.49 29.21,7.49 29.72,7.75 30.23,7.49 30.73,7.49 31.24,7.49 31.75,7.49 32.26,7.49 32.77,7.49 33.27,7.49 33.78,7.49 34.29,7.49 34.8,7.49 35.31,7.49 35.81,7.49 36.32,7.49 36.83,7.49 37.36,7.49 37.9,7.49 40.08,7.49 40.59,7.49 41.1,7.49 41.61,7.49 42.11,7.49 42.62,7.49 43.13,7.49 43.64,7.49 44.15,7.49 44.65,7.49 15.47,16.89 15.49,20.4 17.17,12.07 21.36,12.47 21.84,10.13 27.71,18.69 24.74,10.62 42.09,15.52 35.99,15.39 34.59,14.38 14.27,8.2 15.39,7.42 14.78,7.19 45.75,7.29 46.28,7.06 45.77,8.48 46.38,8.36 46.94,8.13 29.9,23.01 29.9,23.52 29.9,24.03 29.51,24.41 31.04,23.01 31.04,23.52 31.04,24.03 31.42,24.41 45.24,8.61 45.21,7.44 14.73,23.75 15.24,24.26 14.48,23.11 14.99,14.35 14.4,17.37 14.99,15.19 14.99,16.05 30.63,3.05 38.43,7.49 41.45,20.98 42.21,20.98 41.33,22.38 42.34,22.38 43.36,21.87 44.88,21.87 41.33,23.65 42.34,24.64 42.34,23.65 43.61,24.64 43.61,23.77 44.88,24.64 44.88,23.77 44.88,22.89 43.61,22.89 13.72,23.11 12.07,21.34 15.62,21.72 15.49,21.08 15.49,19.68 14.66,18.59 14.71,16.89 12.29,16.64 11.02,17.53 10.39,19.81 10.52,20.95 9.25,19.81 9.37,14.1 8.48,14.86 10.46,13.94 10.08,11.43 14.63,12.93 8.99,11.18 12.42,10.79 11.4,11.43 48.82,23.22 47.04,21.69 49.07,20.93 47.55,22.45 47.04,22.96 48.06,21.95 56.18,15.09 6.2,14.1 40.51,31.52 34.72,28.35 35.36,22.76 36.25,25.68 32.69,20.35 34.21,21.74 37.31,18.49 33.12,10.49 40.56,18.95 41.33,18.95 53.39,16.79 38,2.97 36.47,0.81 28.6,5.13 19.84,27.86 16.92,24.69 16.15,24.18 25.3,23.67 23.01,24.56 20.85,24.56 19.71,24.56 48.56,21.44 17.63,15.98 54.31,17.7 49.71,22.33 49.83,17.68 47.8,21.06 49.71,14.88 48.69,13.11 52.27,11.25 52.37,14.25 51.1,16.41 53.01,15.65 47.93,12.73 47.17,9.55 50.22,10.95 34.72,27.33 34.72,26.19 34.72,23.39 26.44,23.67 27.97,23.29 24.41,24.56 22.12,24.56 28.88,11.33 40.82,29.11 41.96,30.12 50.85,21.56 42.85,14.76 46.79,9.04 52.27,10.19 50.22,12.22 52.27,9.04 38.51,3.99 39.52,4.75 40.54,5.64 40.54,6.53 15.52,6.27 16.03,5.51 16.54,4.62 17.17,3.73 17.93,3.1 13.89,9.09 13.26,9.86 12.22,0.81 27.84,1.45 24.92,1.45 44.09,3.61 44.22,5.77 34.59,24.51 33.32,21.74 34.72,25.55 27.2,23.55 28.73,22.53 18.44,29.39 18.06,26.34 20.73,26.47 19.96,27.23 19.08,26.34 16.41,27.48 7.54,14.83 9.88,13.21 8.76,17.35 10.46,18.8 20.42,9.6 16.28,12.95 12.17,15.62 12.93,15.62 12.93,14.86 24.46,11.07
  pour Top (rank 6): 22.86,34.54 38.1,34.54 60.96,12.7 53.98,0 6.98,0 0,12.7
  pour Route2 (rank 6): 22.86,34.54 38.1,34.54 60.96,12.7 53.98,0 6.98,0 0,12.7
  pour Bottom (rank 6): 22.86,34.54 38.1,34.54 60.96,12.7 53.98,0 6.98,0 0,12.7
GPIO0
  Top 0.203: U10.42 40.71,14.1 40.85,14.24 43.83,14.24 GPIO0.P$1
  pour Top (no thermals): 43.76,15.02 44.57,14.21 45.38,15.02 44.57,15.83
GPIO1
  Top 0.203: U10.43 41.91,14.6 GPIO1.P$1
  pour Top (no thermals): 42.62,16.16 43.43,15.35 44.24,16.16 43.43,16.97
GPIO2
  Top 0.203: U10.29 35.95,9.84 TP5.P$1
GPIO3
  Top 0.203: U10.28 35.45,9.88 TP6.P$1
LED_BLUE
  Top 0.203: U10.40 41.1,13.1 R10.2
LED_GREEN
  Top 0.203: U10.41 41.36,13.6 R9.2
LED_NRF_BLUE  (via drill 0.2)
  Top 0.203: v37.85,23.37 39.69,23.37 U7.J1
  Bottom 0.203: v37.85,23.37 37.52,23.37 R6.2
LED_NRF_GREEN  (via drill 0.2)
  Top 0.203: U7.L1 37.99,22.98 37.87,22.86 v37.85,22.86
  Bottom 0.203: v37.85,22.86 37.26,22.86 R5.2
LED_NRF_RED  (via drill 0.2)
  Top 0.203: U7.K2 v40.3,23.26
  Bottom 0.203: R4.2 37.14,24.72 38.6,23.26 v40.3,23.26
LED_RED
  Top 0.203: R8.2 41.3,11.79 40.48,12.6 U10.39
N$1
  Top 0.152: U2.1 36.55,5.89 36.32,5.66 33.28,5.66 32.99,5.37 32.99,2.35 32.73,2.08 U2.16
  Top 0.203: U2.16 31.44,2.08 31.22,2.31 C28.1
N$2  (via drill 0.2)
  Top 0.203: U7.N24 46.11,22.48 v45.78,22.81
  Bottom 0.203: C21.1 46.2,22.81 v45.78,22.81
N$3
  Top 0.152: 28.98,9.38 28.98,9.4
  Top 0.203: U9.1 28.98,9.38
  Top 0.381: T1.1 arc90 24.33,10.03 28.32,10.03 28.35,10.03 arc-90 28.98,9.4
  pour Top: 28.8,9.4 28.8,9.3 arc90 28.83,9.27 28.83,9.4
N$4
  Top 0.102: T1.3 23.7,11.97 23.7,12.53 23.37,12.86 C6.P$2
N$5  (via drill 0.2)
  Top 0.203: D1.C 28.23,3.72 v25.97,3.72 | U6.5 10.92,16.01 11.3,16.39 v11.55,16.39
  Route15 0.203: v25.97,3.72 19.77,3.72 17.02,6.47 17.02,8.79 14.79,11.01 v14.79,12.1 v14.79,12.11
  Bottom 0.203: v14.79,12.11 11.55,15.34 v11.55,16.39
N$6  (via drill 0.2)
  Top 0.203: U7.C1 39.43,25.36 v39.16,25.36
  Bottom 0.203: v39.16,25.36 39.16,24.77 C32.1
N$7
  Top 0.102: C7.P$2 22.76,12.86 22.43,12.53 22.43,11.97 T1.4
N$8
  Top 0.203: R3.2 17.27,12.85 C22.1
N$9  (via drill 0.2)
  Top 0.203: U7.B5 v41.06,25.48 | v46.86,25.35 46.3,24.79 U7.E24
  Bottom 0.203: C26.1 47.4,24.82 v46.86,25.35 46.86,25.26 46.26,25.87 41.06,25.87 v41.06,25.48 41.06,25.87 40.18,26.74 C56.1 40.01,27.05 39.52,27.05 39.14,27.43 L2.1
N$10  (via drill 0.2)
  Bottom 0.203: U7.D23 46.34,24.73 C18.1
  other vias: 45.8,24.73
N$11
  Top 0.254: U5.4 14.86,19.5 14.86,21.2 C23.1
N$12
  Top 0.203: R17.2 C17.1
N$13
  Top 0.254: U6.8 10.92,13.44 R11.2
N$14
  Top 0.203: U1.12 20.93,15.38 19.29,13.74 C16.1 R3.1
N$15
  Top 0.254: U7.H23 45.96,23.89 47,23.89 C1.1
  Top 0.33: C1.1 47.7,23.17 L1.2
N$16
  Top 0.203: U1.8 19.81,17.18 19.63,17 17.53,17 17.02,16.48 | R17.1 C3.1 17.02,16.48 | 17.02,16.48
N$17
  Top 0.33: A4.S1 50.9,19.99 C2.1 49.61,21.26 L1.1
N$18
  Top 0.203: U7.B24 46.31,26.05 44.62,27.74 44.17,28.17 arc42 X3.3 41.3,29.76 C8.2
N$19
  Top 0.203: U7.A23 45.8,26.05 45.47,26.39 42.29,26.39 41.58,26.39 arc-57 X3.1 39.35,27.81 C9.2
N$20  (via drill 0.2)
  Bottom 0.203: U7.B3 39.87,26.16 L6.2
  other vias: 40.55,25.48
N$21
  Top 0.203: U1.5 19.94,18.38 19.28,19.04 16.61,19.04 16.26,18.68 R15.2
N$22
  Top 0.203: U10.44 41.14,15.1 R16.1
N$23  (via drill 0.2)
  Top 0.203: R9.1 43.87,13.67 D3.4 43.74,13.26 v43.69,13.21 | v46.36,13.23 46.43,13.23 47.02,13.23 TP7.P$1
  Bottom 0.203: v43.69,13.21 46.33,13.21 v46.36,13.23
N$24  (via drill 0.2)
  Top 0.203: v43.69,12.27 44.14,12.27 D3.3 43.92,12.75 42.32,12.75 R10.1 | v46.36,12.14 46.94,12.14 46.91,12.12 47.07,12.12 TP9.P$1
  Bottom 0.203: v43.69,12.27 46.23,12.27 v46.36,12.14
N$25
  Top 0.203: R8.1 44.32,11.79 44.42,11.68 | 44.42,11.68 D3.2 | TP8.P$1 45.31,10.79 44.55,11.56 44.42,11.68
N$26
  Top 0.203: U1.36 27.8,20.95 TP11.P$1
N$27
  Top 0.203: U1.35 28.43,19.58 TP12.P$1
N$28
  cutout Route2: 4.08,5.7 12.43,10.34 15.96,4.3 8.76,0.13 7.11,0.13 4.08,5.7
  cutout Route15: 4.08,5.7 12.43,10.34 15.96,4.3 8.76,0.13 7.11,0.13 4.08,5.7
N$29
  cutout Route2: 45.09,4.55 48.51,10.41 56.85,5.61 53.85,0.25 52.2,0.25
  cutout Route15: 45.09,4.55 48.51,10.41 56.85,5.61 53.85,0.25 52.2,0.25
N$30
  cutout Route2: 26.67,34.42 26.67,24.38 34.29,24.38 34.29,34.42
  cutout Route15: 26.67,34.42 26.67,24.38 34.29,24.38 34.29,34.42
N$31
  cutout Top: 50.98,21.31 49.67,20 49.67,19.19 52.08,16.78 52.77,16.78 54.21,18.21 54.21,18.9 51.8,21.31
  cutout Bottom: 50.98,21.31 49.67,20 49.67,19.19 52.08,16.78 52.77,16.78 54.21,18.21 54.21,18.9 51.8,21.31
  cutout Route15: 50.98,21.31 49.67,20 49.67,19.19 52.08,16.78 52.77,16.78 54.21,18.21 54.21,18.9 51.8,21.31
  cutout Route2: 50.98,21.31 49.67,20 49.67,19.19 52.08,16.78 52.77,16.78 54.21,18.21 54.21,18.9 51.8,21.31
N$32
  cutout Route15: 29.97,17.02 31.5,17.02 31.5,12.19 29.59,12.19 29.59,17.02
N$33
  Top 0.203: U2.30 38.11,4.58 R1.1
N$34  (via drill 0.2)
  Top 0.203: U2.2 v36.05,6.75 | R2.1 v32.44,6.75 v32.44,6.76
  Top 0.254: v36.05,6.75 v36.05,6.76
  Route15 0.203: v32.44,6.76 32.92,6.27 35.57,6.27 v36.05,6.76
N$37
  Bottom 0.203: L6.1 38.05,26.38 L2.2
N$55
  Bottom 0.203: J2.4 44.8,17.4 | 44.8,17.4 44.8,18.52 U8.1 | 44.8,17.4 43.87,18.34 U8.2 U8.1 | R19.2 52.32,16.56 49.66,19.23 C60.1 R14.2 R13.2 R12.2 45.53,18.53 U8.1
N$59  (via drill 0.2)
  Top 0.203: v37.16,25.83 37.16,26.34 D2.2
  Bottom 0.203: R4.1 37.16,25.65 v37.16,25.83
N$60  (via drill 0.2)
  Top 0.203: v35.69,27.23 D2.4
  Bottom 0.203: R5.1 35.26,23.75 35.26,26.8 v35.69,27.23
N$61  (via drill 0.2)
  Top 0.203: v35.69,26.36 D2.3
  Bottom 0.203: R6.1 35.69,24.33 v35.69,26.36
NRF_GPIO_0  (via drill 0.2)
  Top 0.203: U7.H2 v40.3,23.76 v40.31,23.76 | v35.33,28.12 TP13.P$1
  Route15 0.203: v40.31,23.76 40.19,23.76 39.97,23.55 38.64,23.55 36.7,25.49 36.7,26.32 36.22,26.8 36.22,27.52 35.63,28.12 v35.33,28.12
NRF_GPIO_1  (via drill 0.2)
  Top 0.203: U7.G1 v39.8,23.95 | v36.73,27.71 TP14.P$1
  Route15 0.203: v39.8,23.95 36.73,27.03 v36.73,27.71
NRF_IMU_INT1
  Top 0.203: U3.12 46.87,17.08 45.67,18.28 45.18,18.28 44.3,19.15 U7.AD18
NRF_IMU_INT2
  Top 0.203: U7.AD20 44.8,19.26 45.3,18.76 45.8,18.76 47.37,17.19 U3.11
NRF_MISO  (via drill 0.2)
  Top 0.203: 44.67,17.04 42.71,19 42.3,19.41 U7.AD10 | 44.67,17.04 | 44.67,17.04 46.21,15.5 U3.3 v45.67,15.5 v45.67,15.49
  Bottom 0.203: R14.1 48.23,18.33 48.23,16.66 J2.7 48.13,16.51 48.13,15.49 47.83,15.19 45.97,15.19 v45.67,15.49
NRF_MOSI  (via drill 0.2)
  Top 0.203: v43.61,17.47 41.8,19.28 U7.AD8 | v46.36,14.35 46.36,14.99 U3.4
  Route15 0.203: v43.61,17.47 44.01,17.87 v45.36,17.87
  Bottom 0.203: v43.61,17.47 43.61,16.63 J2.3 43.7,16.41 43.74,16.37 43.74,15.85 45.25,14.35 v46.36,14.35 | v45.36,17.87 45.85,18.36 R12.1
NRF_SCK  (via drill 0.2)
  Top 0.203: U7.AD12 44.84,17.45 v45.92,17.45 46.34,17.03 46.34,16.52 U3.1
  Bottom 0.203: v45.92,17.45 45.92,16.56 J2.5
NRF_SWDCLK  (via drill 0.2)
  Top 0.203: J4.4 55.36,12.66 v55.19,12.5
  Bottom 0.203: U7.AA24 50.33,20.48 50.8,20.95 51.73,20.95 51.91,20.79 55.7,16.99 55.7,13.01 v55.19,12.5
  other vias: 46.3,20.48
NRF_SWDIO  (via drill 0.2)
  Top 0.203: U7.AC24 v46.3,19.97 | v54.51,12.34 54.91,11.94 56.96,11.94 J4.2
  Bottom 0.203: v46.3,19.97 49.54,19.97 53.66,15.86 53.66,14.95 54.51,14.1 v54.51,12.34
OSC_IN
  Top 0.203: X2.1 37.43,20.99 | 37.43,20.99 37.7,21.26 C14.1 | U10.5 37.45,18.03 38.29,18.87 38.29,20.14 38.08,20.35 38.07,20.35 37.43,20.99
OSC_OUT
  Top 0.203: U10.6 36.95,18.27 X2.3 35.57,19.54 34.26,20.85 C15.1
REG_EN  (via drill 0.2)
  Top 0.203: U1.21 v24.88,14.02 | v18.16,11.94 18.15,11.92 U4.2
  Bottom 0.203: v24.88,14.02 24.6,13.74 19.96,13.74 v18.16,11.94
RF1
  Top 0.152: U9.4 28.99,8.11 29.01,8.09
  Top 0.203: A1.A
  Top 0.33: 29.01,8.09 17.78,8.09 16.26,8.09 arc40 A1.A
RF2
  Top 0.203: U9.5 30.44,8.11 | 30.44,8.11 30.47,8.08 30.47,8.14 U9.5 | U9.5 30.44,8.11 | U9.5 30.43,8.09
  Top 0.33: 30.43,8.09 43.18,8.09 44.7,8.09 arc-36 A2.A
RF3
  Top 0.102: U9.8 30.46,9.38 | 30.46,9.38
  Top 0.152: 30.46,9.88 30.46,9.38
  Top 0.33: 30.46,23.24 30.46,21.74 30.46,9.88 | 30.46,23.24 | 30.46,23.24 30.46,24.74 arc-6 A3.A
  pour Top (no thermals): 30.61,9.42 30.61,9.86 30.3,9.86 30.28,9.42
RF_N
  Top 0.102: U1.17 23.29,14.81 | 23.29,14.81 | 23.29,14.81 23.27,14.79 23.27,13.45 23.37,13.35 C6.P$1
RF_P
  Top 0.102: U1.16 22.86,14.81 22.86,13.45 22.76,13.35 C7.P$1
SD_EN  (via drill 0.2)
  Top 0.203: U7.AC9 v42.04,19.98
  Bottom 0.203: R18.1 42.72,18.34 U8.3 42.92,18.56 42.04,19.44 v42.04,19.98
STM_INTERRUPT  (via drill 0.2)
  Top 0.203: U10.12 33.81,17.87 v33.43,17.87 TP3.TP
  Bottom 0.203: U7.N1 38.04,22.48 v33.43,17.87
  other vias: 39.8,22.48
STM_SWCLK  (via drill 0.2)
  Top 0.203: U10.37 40.7,11.6 v40.72,11.63 | v40.72,11.63 | v40.72,11.63 v40.72,11.62 | v3.94,14.35 4.38,13.91 J5.4
  Bottom 0.203: v40.72,11.62 40.72,10.74 39.65,9.68 39.65,6.8 38.42,5.56 17.68,5.56 16.36,6.89 16.36,8.66 15.34,9.68 14.31,9.68 11.75,12.23 6.05,12.23 v3.94,14.35
STM_SWDIO  (via drill 0.2)
  Top 0.203: U10.34 38.45,10.6 38.2,10.34 v37.94,10.34 | v2.92,13.84 3.28,13.48 J5.2
  Bottom 0.203: v37.94,10.34 37.94,10.23 38.91,9.26 38.91,7.18 38.03,6.3 17.96,6.3 17.07,7.19 17.07,8.97 15.62,10.41 14.61,10.41 8.56,16.46 5.4,16.46 2.92,13.98 v2.92,13.84
VBAT  (via drill 0.2)
  Top 0.203: R22.2 8.76,18.26 C58.1 11.32,18.27 U5.3 | U7.B9 v42.05,25.46
  Top 0.254: U6.3 14.32,15.44 14.48,15.6 14.48,15.8 14.34,15.94 U6.4
  Top 0.381: U5.3 11.42,18.36 | 11.42,18.36 11.86,18.36 12.44,18.95 12.44,19.58 11.86,20.16 11.42,20.16 U5.1 | U6.4 12.95,16.81 C68.1 12.79,16.99 11.42,18.36
  Top 0.508: J1.P 15.45,25.74 11.37,21.65 U5.1
  Route15 0.203: J1.P 20.74,25.74 21.26,26.26 21.97,26.26 25.17,23.06 26.47,23.06 27.56,21.97 27.56,20.83 29.84,18.54 32.62,18.54 35.21,21.13 38.7,21.13 38.9,20.93 40.08,20.93 40.79,21.65 40.79,24.78 41.06,25.04 41.63,25.04 v42.05,25.46
VDDCLK
  Top 0.203: U1.9 19.96,16.78 19.65,16.47 19.06,16.47 C39.1
VDDDIG  (via drill 0.2)
  Top 0.152: U1.20 24.48,14.42 24.43,14.37 24.43,13.82 24.69,13.56 25.73,13.56 26.44,14.27 | 26.61,14.44 26.44,14.27 | 26.41,14.16 26.44,14.19 26.44,14.24 26.44,14.27
  Top 0.203: U1.44 v23.28,21.97 23.28,22.49 23.01,22.76 C35.1 | 26.41,14.16 28.62,14.16 28.98,13.8 C36.1 | v26.66,14.44 26.61,14.44
  Route15 0.33: 26.09,14.91 26.56,14.44 v26.66,14.44
  Route15 0.381: 26.09,14.91 26.09,19.98 24.09,21.97 v23.28,21.97
VDDIF
  Top 0.203: U1.7 19.05,17.58 C42.1
VDDIO
  Top 0.102: U1.42 24.12,20.69 | 24.12,20.69
  Top 0.152: U1.31 26.79,18.02 26.28,18.02 26.11,18.2 26.11,19.88 25.93,20.05 24.25,20.05 24.12,20.18 24.12,20.69
  Top 0.203: U1.42 24.08,22.86 C41.1 | U1.31 27.89,17.98 C53.1 | U1.31
VDDMS
  Top 0.203: U1.6 20.91,18 19.82,18 19.42,18.39 C38.1
VDDSYN
  Top 0.203: U1.10 20.14,16.38 19.3,15.54 19.05,15.54 C40.1
VDDVCO
  Top 0.203: C43.1 20.37,15.96 20.91,15.96 U1.11
VUSB  (via drill 0.2)
  Top 0.203: U2.19 34.05,1.06 33.42,0.42 31.89,0.42 31.28,1.03 31.22,1.09 R7.2
  Top 0.254: U6.2 14.35,14.94 14.48,14.81 14.48,14.55 14.36,14.44 U6.1 13.94,14.32
  Top 0.381: 31.28,1.03 30.76,0.51 29.86,0.51 28.9,1.46 28.9,2.9 v28.89,2.91 | v14.2,11.58 14.2,11.6 13.94,11.86 C67.1 13.95,12.3 C54.1 13.94,14.32
  Route15 0.381: v31.77,5.11 29.84,3.17 29.16,3.17 | 29.16,3.17 19.69,3.17 16.57,6.29 16.57,8.4 14.2,10.78 v14.2,11.58 | v28.89,2.91 29.16,3.17
  Bottom 0.381: J3.1 v31.78,5.1 v31.77,5.11
  pour Route15: 14.48,10.93 14.48,11.81 14.22,12.07 13.72,12.07 13.46,11.81 13.46,10.71 16.13,8.26 16.13,6.1 19.81,2.16 29.84,2.16 32.89,4.83 32.89,5.71 32.51,6.1 31.12,6.1 28.7,3.81 26.67,3.81 26.04,3.43 19.81,3.43 16.84,6.4 16.84,8.64
XL3
  Top 0.152: U7.D2 40.09,24.73 40.01,24.65 38.76,24.65 X1.A
  Top 0.203: C11.2 38.31,25.02 X1.A
XL4
  Top 0.152: U7.F2 40.12,24.23 40.02,24.34 38.73,24.34 X1.B
  Top 0.203: X1.B 37.05,23.96 C10.2
XTAL1
  Top 0.203: U1.3 20.91,19.2 20.37,19.2 20.19,19.38 20.19,20.69 19.92,20.96 C13.1 18.83,21.78 X4.3
XTAL2
  Top 0.203: 17.63,19.51 17.7,19.51 19.44,19.51 20.16,18.78 U1.4 | X4.1 17.48,19.51 17.63,19.51 | 17.63,19.51 16.05,19.51 15.24,18.7 C12.1

## Text on the board
tPlace: GPIO0 | GPIO1 | GND | +3V3 | IO2 | IO3 | STM | GND | G | STM | B | nRF | R | IO3 | IO2 | SquarePoint | v3.2 | TotTag | D | Andreas Biri, Pat Pannuto | 2018-08-09
bPlace: SCL | SDA